# EasyEDA schematic SSP_SCH.json
TITLE: Sheet_1; REV: 1.0; Date: 2020-03-20; Sheet: 1/1; Drawn By: moreiralucascde; Company: Your Company
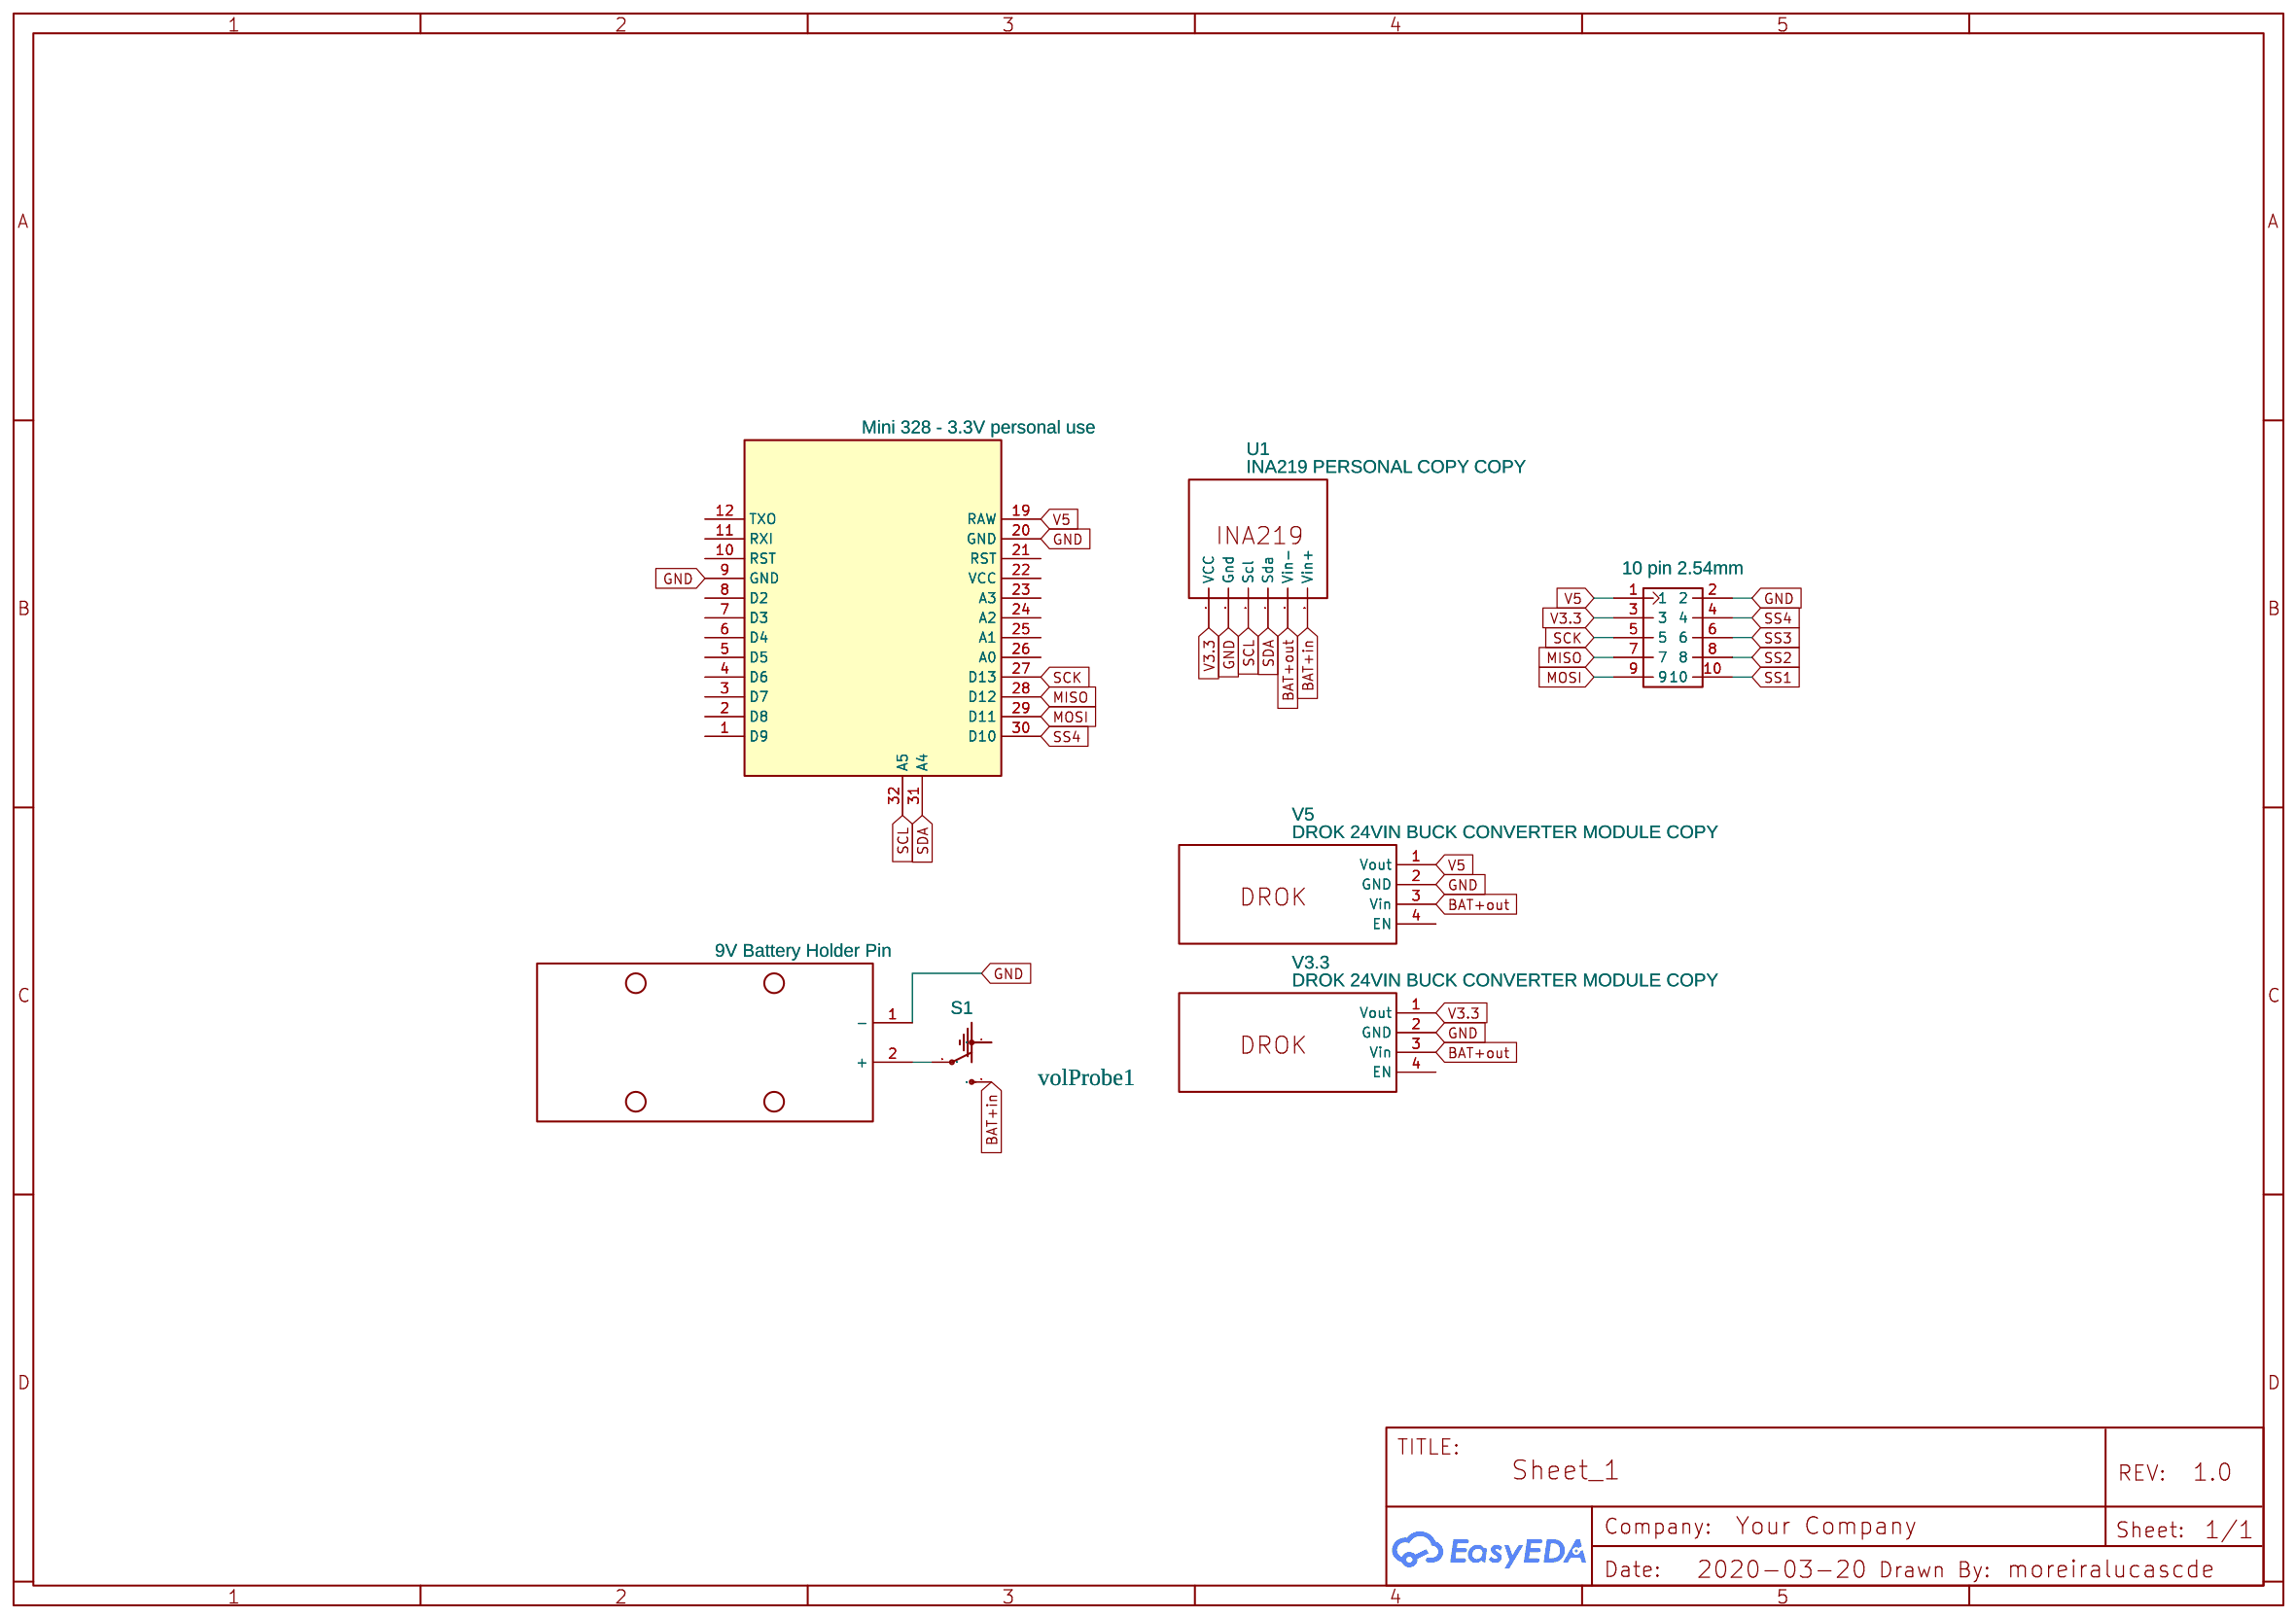
[diagram p0: schematic sheet]

## Parts
BUS  10 pin 2.54mm  [10 PIN 2.54MM LUCAS]
H1  9V Battery Holder Pin  [9V BATTERY HOLDER PIN]
P1  Mini 328 - 3.3V personal use  [MINI 328 - 3.3V SIN FTDI]
S1  SWITCH-SPSTKIT  [SWITCH-SPDT_KIT]
U1  INA219 PERSONAL COPY COPY  [INA219_PCB WITHOUT HOLE COPY SIN VIN]
V3  DROK 24VIN BUCK CONVERTER MODULE COPY  [DROK 24VIN BUCK CONVERTER MODULE]  (section 3)
V5  DROK 24VIN BUCK CONVERTER MODULE COPY  [DROK 24VIN BUCK CONVERTER MODULE]

## Library data of the parts
BUS = 10 pin 2.54mm: Manufacturer: Amphenol ICC (FCI); Manufacturer Part: 67997-410HLF; Supplier: Digi-Key; Supplier Part: 609-3243-ND; link: https://www.digikey.com/product-detail/en/67997-410HLF/609-3243-ND/1878475/?itemSeq=298559326; Contributor: Yugi
H1 = 9V Battery Holder Pin: Manufacturer: Keystone Electronics; Manufacturer Part: 1294; Supplier: Digi-Key; Supplier Part: 36-1294-ND; link: https://www.keyelco.com/userAssets/file/M65p33.pdf; Contributor: Lucas Moreira
P1 = Mini 328 - 3.3V personal use: sourceId: 1T5FDZYC8; Contributor: Lucas Moreira
S1 = SWITCH-SPSTKIT: SPST Switch; Contributor: Pinoccio
U1 = INA219 PERSONAL COPY COPY: Supplier: Mouser; Supplier Part: 485-904; link: https://www.adafruit.com/product/904; Contributor: Tiberius Vinczi
V3 V5 = DROK 24VIN BUCK CONVERTER MODULE COPY: Manufacturer: Amazon; Manufacturer Part: DROK - Amazon; link: https://www.amazon.com/dp/B0758ZTS61?ref=ppx_pop_mob_ap_share; Contributor: jjzoller

## Nets
GND: BUS.2 H1.1(-) P1.9(GND) P1.20(GND) U1.2(Gnd) V3.2(GND) V5.2(GND)
V3.3: BUS.3 U1.1(VCC) V3.1(Vout)
V5: BUS.1 P1.19(RAW) V5.1(Vout)
BAT+in: S1.3(S) U1.6(Vin+)
BAT+out: U1.5(Vin-) V3.3(Vin) V5.3(Vin)
MISO: BUS.7 P1.28(D12)
MOSI: BUS.9 P1.29(D11)
SCK: BUS.5 P1.27(D13)
SCL: P1.32(A5) U1.3(Scl)
SDA: P1.31(A4) U1.4(Sda)
SS1: BUS.10
SS2: BUS.8
SS3: BUS.6
SS4: BUS.4 P1.30(D10)
volProbe1: S1.1(O)
Net-(H1-2): H1.2(+) S1.2(P)

Not connected (* = marked no-connect by the designer): P1 1(D9) 2(D8) 3(D7) 4(D6) 5(D5) 6(D4) 7(D3) 8(D2) 10(RST) 11(RXI) 12(TXO) 21(RST) 22(VCC) 23(A3) 24(A2) 25(A1) 26(A0); V3 4(EN); V5 4(EN)
